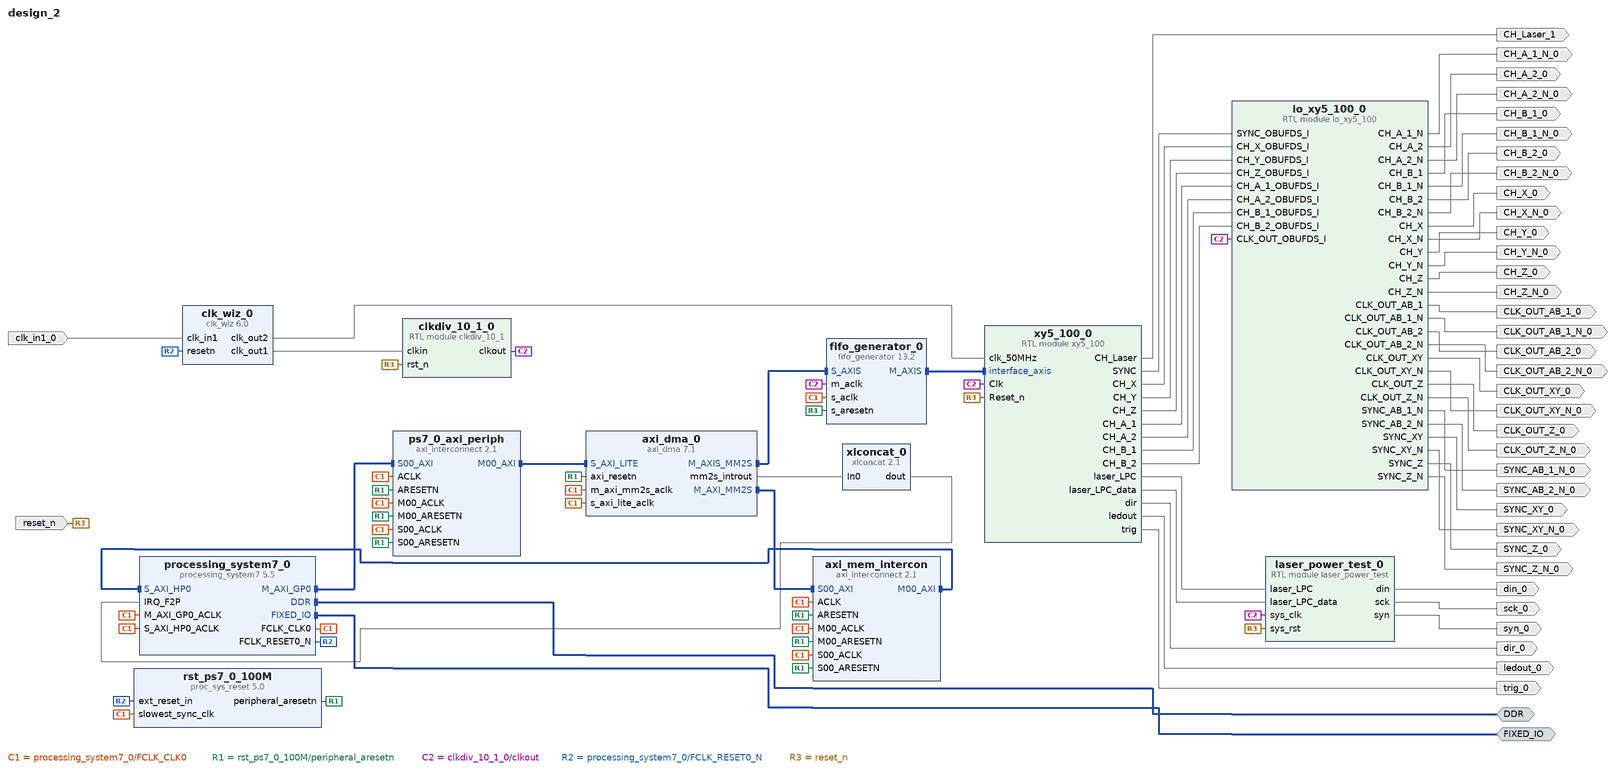
[diagram p0: block diagram of the top level]
# Vivado block design design_2, xc7z020clg400-2, Vivado 2020.2
create_bd_design design_2

create_bd_intf_port -mode Master -vlnv xilinx.com:interface:ddrx_rtl:1.0 DDR
create_bd_intf_port -mode Master -vlnv xilinx.com:display_processing_system7:fixedio_rtl:1.0 FIXED_IO
create_bd_port -dir I -type clk clk_in1_0
set_property -dict {CONFIG.FREQ_HZ 50000000} [get_bd_ports clk_in1_0]
create_bd_port -dir O CH_A_1_N_0
create_bd_port -dir O CH_A_2_0
create_bd_port -dir O CH_A_2_N_0
create_bd_port -dir O CH_B_1_0
create_bd_port -dir O CH_B_1_N_0
create_bd_port -dir O CH_B_2_0
create_bd_port -dir O CH_B_2_N_0
create_bd_port -dir O CH_X_0
create_bd_port -dir O CH_X_N_0
create_bd_port -dir O CH_Y_0
create_bd_port -dir O CH_Y_N_0
create_bd_port -dir O CH_Z_0
create_bd_port -dir O CH_Z_N_0
create_bd_port -dir O CLK_OUT_AB_1_0
create_bd_port -dir O CLK_OUT_AB_1_N_0
create_bd_port -dir O CLK_OUT_AB_2_0
create_bd_port -dir O CLK_OUT_AB_2_N_0
create_bd_port -dir O CLK_OUT_XY_0
create_bd_port -dir O CLK_OUT_XY_N_0
create_bd_port -dir O CLK_OUT_Z_0
create_bd_port -dir O CLK_OUT_Z_N_0
create_bd_port -dir O SYNC_AB_1_N_0
create_bd_port -dir O SYNC_AB_2_N_0
create_bd_port -dir O SYNC_XY_0
create_bd_port -dir O SYNC_XY_N_0
create_bd_port -dir O SYNC_Z_0
create_bd_port -dir O SYNC_Z_N_0
create_bd_port -dir I -type rst reset_n
create_bd_port -dir O ledout_0
create_bd_port -dir O CH_Laser_1
create_bd_port -dir O din_0
create_bd_port -dir O sck_0
create_bd_port -dir O syn_0
create_bd_port -dir O dir_0
create_bd_port -dir O trig_0

create_bd_cell -type ip -vlnv xilinx.com:ip:processing_system7:5.5 processing_system7_0
set_property -dict [list \
  CONFIG.PCW_APU_PERIPHERAL_FREQMHZ 666.666666 \
  CONFIG.PCW_CPU_CPU_6X4X_MAX_RANGE 767 \
  CONFIG.PCW_ENET0_ENET0_IO {MIO 16 .. 27} \
  CONFIG.PCW_ENET0_GRP_MDIO_ENABLE 1 \
  CONFIG.PCW_ENET0_GRP_MDIO_IO {MIO 52 .. 53} \
  CONFIG.PCW_ENET0_PERIPHERAL_ENABLE 1 \
  CONFIG.PCW_FPGA0_PERIPHERAL_FREQMHZ 100 \
  CONFIG.PCW_FPGA1_PERIPHERAL_FREQMHZ 50 \
  CONFIG.PCW_GPIO_MIO_GPIO_ENABLE 0 \
  CONFIG.PCW_IRQ_F2P_INTR 1 \
  CONFIG.PCW_PERIPHERAL_BOARD_PRESET None \
  CONFIG.PCW_PRESET_BANK1_VOLTAGE {LVCMOS 1.8V} \
  CONFIG.PCW_QSPI_PERIPHERAL_ENABLE 0 \
  CONFIG.PCW_SD0_GRP_CD_ENABLE 0 \
  CONFIG.PCW_SD0_GRP_WP_ENABLE 0 \
  CONFIG.PCW_SD0_PERIPHERAL_ENABLE 1 \
  CONFIG.PCW_SD0_SD0_IO {MIO 40 .. 45} \
  CONFIG.PCW_SDIO_PERIPHERAL_FREQMHZ 100 \
  CONFIG.PCW_UART0_PERIPHERAL_ENABLE 1 \
  CONFIG.PCW_UART0_UART0_IO {MIO 14 .. 15} \
  CONFIG.PCW_UART1_PERIPHERAL_ENABLE 0 \
  CONFIG.PCW_UART_PERIPHERAL_FREQMHZ 100 \
  CONFIG.PCW_UIPARAM_DDR_FREQ_MHZ 533.333333 \
  CONFIG.PCW_UIPARAM_DDR_PARTNO {MT41J256M16 RE-125} \
  CONFIG.PCW_USB0_PERIPHERAL_ENABLE 0 \
  CONFIG.PCW_USE_FABRIC_INTERRUPT 1 \
  CONFIG.PCW_USE_S_AXI_HP0 1 \
] [get_bd_cells processing_system7_0]
# 411 more settings of processing_system7_0 are not shown: defaults, MIO pin electricals, DDR timing, and values the tool derives
create_bd_cell -type module -reference clkdiv_10_1 clkdiv_10_1_0
create_bd_cell -type ip -vlnv xilinx.com:ip:axi_dma:7.1 axi_dma_0
set_property -dict [list \
  CONFIG.c_include_s2mm 0 \
  CONFIG.c_include_sg 0 \
  CONFIG.c_m_axi_mm2s_data_width 128 \
  CONFIG.c_m_axis_mm2s_tdata_width 128 \
  CONFIG.c_mm2s_burst_size 256 \
  CONFIG.c_sg_length_width 26 \
] [get_bd_cells axi_dma_0]
create_bd_cell -type ip -vlnv xilinx.com:ip:clk_wiz:6.0 clk_wiz_0
set_property -dict [list \
  CONFIG.CLKIN1_JITTER_PS 200.0 \
  CONFIG.CLKOUT1_JITTER 249.363 \
  CONFIG.CLKOUT1_PHASE_ERROR 164.985 \
  CONFIG.CLKOUT1_REQUESTED_OUT_FREQ 20.000 \
  CONFIG.CLKOUT2_JITTER 192.113 \
  CONFIG.CLKOUT2_PHASE_ERROR 164.985 \
  CONFIG.CLKOUT2_REQUESTED_OUT_FREQ 50.000 \
  CONFIG.CLKOUT2_USED true \
  CONFIG.MMCM_CLKFBOUT_MULT_F 20.000 \
  CONFIG.MMCM_CLKIN1_PERIOD 20.000 \
  CONFIG.MMCM_CLKIN2_PERIOD 10.0 \
  CONFIG.MMCM_CLKOUT0_DIVIDE_F 50.000 \
  CONFIG.MMCM_CLKOUT1_DIVIDE 20 \
  CONFIG.NUM_OUT_CLKS 2 \
  CONFIG.PRIM_IN_FREQ 50.000 \
  CONFIG.RESET_PORT resetn \
  CONFIG.RESET_TYPE ACTIVE_LOW \
] [get_bd_cells clk_wiz_0]
create_bd_cell -type ip -vlnv xilinx.com:ip:axi_interconnect:2.1 ps7_0_axi_periph
set_property -dict {CONFIG.NUM_MI 1} [get_bd_cells ps7_0_axi_periph]
create_bd_cell -type ip -vlnv xilinx.com:ip:proc_sys_reset:5.0 rst_ps7_0_100M
create_bd_cell -type ip -vlnv xilinx.com:ip:axi_interconnect:2.1 axi_mem_intercon
set_property -dict {CONFIG.NUM_MI 1} [get_bd_cells axi_mem_intercon]
create_bd_cell -type ip -vlnv xilinx.com:ip:xlconcat:2.1 xlconcat_0
create_bd_cell -type ip -vlnv xilinx.com:ip:fifo_generator:13.2 fifo_generator_0
set_property -dict [list \
  CONFIG.Clock_Type_AXI Independent_Clock \
  CONFIG.Enable_Safety_Circuit true \
  CONFIG.FIFO_Implementation_axis Independent_Clocks_Block_RAM \
  CONFIG.FIFO_Implementation_rach Independent_Clocks_Distributed_RAM \
  CONFIG.FIFO_Implementation_rdch Independent_Clocks_Block_RAM \
  CONFIG.FIFO_Implementation_wach Independent_Clocks_Distributed_RAM \
  CONFIG.FIFO_Implementation_wdch Independent_Clocks_Block_RAM \
  CONFIG.FIFO_Implementation_wrch Independent_Clocks_Distributed_RAM \
  CONFIG.Full_Flags_Reset_Value 1 \
  CONFIG.INTERFACE_TYPE AXI_STREAM \
  CONFIG.TDATA_NUM_BYTES 16 \
] [get_bd_cells fifo_generator_0]
create_bd_cell -type module -reference laser_power_test laser_power_test_0
create_bd_cell -type module -reference io_xy5_100 io_xy5_100_0
create_bd_cell -type module -reference xy5_100 xy5_100_0

# ---- connections ----

connect_bd_intf_net [get_bd_intf_pins fifo_generator_0/S_AXIS] [get_bd_intf_pins axi_dma_0/M_AXIS_MM2S]
connect_bd_intf_net [get_bd_intf_pins processing_system7_0/M_AXI_GP0] [get_bd_intf_pins ps7_0_axi_periph/S00_AXI]
connect_bd_intf_net [get_bd_intf_pins ps7_0_axi_periph/M00_AXI] [get_bd_intf_pins axi_dma_0/S_AXI_LITE]
connect_bd_intf_net [get_bd_intf_pins axi_mem_intercon/M00_AXI] [get_bd_intf_pins processing_system7_0/S_AXI_HP0]
connect_bd_intf_net [get_bd_intf_pins axi_dma_0/M_AXI_MM2S] [get_bd_intf_pins axi_mem_intercon/S00_AXI]
connect_bd_intf_net [get_bd_intf_ports DDR] [get_bd_intf_pins processing_system7_0/DDR]
connect_bd_intf_net [get_bd_intf_pins fifo_generator_0/M_AXIS] [get_bd_intf_pins xy5_100_0/interface_axis]
connect_bd_intf_net [get_bd_intf_ports FIXED_IO] [get_bd_intf_pins processing_system7_0/FIXED_IO]
connect_bd_net [get_bd_pins clk_wiz_0/clk_out1] [get_bd_pins clkdiv_10_1_0/clkin]
connect_bd_net -net clk_in1_0_1 [get_bd_ports clk_in1_0] [get_bd_pins clk_wiz_0/clk_in1]
connect_bd_net [get_bd_pins processing_system7_0/FCLK_CLK0] \
  [get_bd_pins processing_system7_0/M_AXI_GP0_ACLK] [get_bd_pins ps7_0_axi_periph/S00_ACLK] \
  [get_bd_pins rst_ps7_0_100M/slowest_sync_clk] [get_bd_pins axi_dma_0/s_axi_lite_aclk] \
  [get_bd_pins ps7_0_axi_periph/M00_ACLK] [get_bd_pins ps7_0_axi_periph/ACLK] [get_bd_pins axi_dma_0/m_axi_mm2s_aclk] \
  [get_bd_pins axi_mem_intercon/S00_ACLK] [get_bd_pins processing_system7_0/S_AXI_HP0_ACLK] \
  [get_bd_pins axi_mem_intercon/M00_ACLK] [get_bd_pins axi_mem_intercon/ACLK] [get_bd_pins fifo_generator_0/s_aclk]
connect_bd_net [get_bd_pins rst_ps7_0_100M/peripheral_aresetn] \
  [get_bd_pins ps7_0_axi_periph/S00_ARESETN] [get_bd_pins axi_dma_0/axi_resetn] [get_bd_pins ps7_0_axi_periph/M00_ARESETN] \
  [get_bd_pins ps7_0_axi_periph/ARESETN] [get_bd_pins axi_mem_intercon/S00_ARESETN] \
  [get_bd_pins axi_mem_intercon/M00_ARESETN] [get_bd_pins axi_mem_intercon/ARESETN] [get_bd_pins fifo_generator_0/s_aresetn]
connect_bd_net [get_bd_pins xy5_100_0/SYNC] [get_bd_pins io_xy5_100_0/SYNC_OBUFDS_I]
connect_bd_net [get_bd_pins xy5_100_0/CH_X] [get_bd_pins io_xy5_100_0/CH_X_OBUFDS_I]
connect_bd_net [get_bd_pins xy5_100_0/CH_Y] [get_bd_pins io_xy5_100_0/CH_Y_OBUFDS_I]
connect_bd_net [get_bd_pins xy5_100_0/CH_Z] [get_bd_pins io_xy5_100_0/CH_Z_OBUFDS_I]
connect_bd_net [get_bd_pins xy5_100_0/CH_A_1] [get_bd_pins io_xy5_100_0/CH_A_1_OBUFDS_I]
connect_bd_net [get_bd_pins xy5_100_0/CH_A_2] [get_bd_pins io_xy5_100_0/CH_A_2_OBUFDS_I]
connect_bd_net [get_bd_pins xy5_100_0/CH_B_1] [get_bd_pins io_xy5_100_0/CH_B_1_OBUFDS_I]
connect_bd_net [get_bd_pins xy5_100_0/CH_B_2] [get_bd_pins io_xy5_100_0/CH_B_2_OBUFDS_I]
connect_bd_net [get_bd_pins io_xy5_100_0/CH_A_1_N] [get_bd_ports CH_A_1_N_0]
connect_bd_net [get_bd_pins io_xy5_100_0/CH_A_2] [get_bd_ports CH_A_2_0]
connect_bd_net [get_bd_pins io_xy5_100_0/CH_A_2_N] [get_bd_ports CH_A_2_N_0]
connect_bd_net [get_bd_pins io_xy5_100_0/CH_B_1] [get_bd_ports CH_B_1_0]
connect_bd_net [get_bd_pins io_xy5_100_0/CH_B_1_N] [get_bd_ports CH_B_1_N_0]
connect_bd_net [get_bd_pins io_xy5_100_0/CH_B_2] [get_bd_ports CH_B_2_0]
connect_bd_net [get_bd_pins io_xy5_100_0/CH_B_2_N] [get_bd_ports CH_B_2_N_0]
connect_bd_net [get_bd_pins io_xy5_100_0/CH_X] [get_bd_ports CH_X_0]
connect_bd_net [get_bd_pins io_xy5_100_0/CH_X_N] [get_bd_ports CH_X_N_0]
connect_bd_net [get_bd_pins io_xy5_100_0/CH_Y] [get_bd_ports CH_Y_0]
connect_bd_net [get_bd_pins io_xy5_100_0/CH_Y_N] [get_bd_ports CH_Y_N_0]
connect_bd_net [get_bd_pins io_xy5_100_0/CH_Z] [get_bd_ports CH_Z_0]
connect_bd_net [get_bd_pins io_xy5_100_0/CH_Z_N] [get_bd_ports CH_Z_N_0]
connect_bd_net [get_bd_pins io_xy5_100_0/CLK_OUT_AB_1] [get_bd_ports CLK_OUT_AB_1_0]
connect_bd_net [get_bd_pins io_xy5_100_0/CLK_OUT_AB_1_N] [get_bd_ports CLK_OUT_AB_1_N_0]
connect_bd_net [get_bd_pins io_xy5_100_0/CLK_OUT_AB_2] [get_bd_ports CLK_OUT_AB_2_0]
connect_bd_net [get_bd_pins io_xy5_100_0/CLK_OUT_AB_2_N] [get_bd_ports CLK_OUT_AB_2_N_0]
connect_bd_net [get_bd_pins io_xy5_100_0/CLK_OUT_XY] [get_bd_ports CLK_OUT_XY_0]
connect_bd_net [get_bd_pins io_xy5_100_0/CLK_OUT_XY_N] [get_bd_ports CLK_OUT_XY_N_0]
connect_bd_net [get_bd_pins io_xy5_100_0/CLK_OUT_Z] [get_bd_ports CLK_OUT_Z_0]
connect_bd_net [get_bd_pins io_xy5_100_0/CLK_OUT_Z_N] [get_bd_ports CLK_OUT_Z_N_0]
connect_bd_net [get_bd_pins io_xy5_100_0/SYNC_AB_1_N] [get_bd_ports SYNC_AB_1_N_0]
connect_bd_net [get_bd_pins io_xy5_100_0/SYNC_AB_2_N] [get_bd_ports SYNC_AB_2_N_0]
connect_bd_net [get_bd_pins io_xy5_100_0/SYNC_XY] [get_bd_ports SYNC_XY_0]
connect_bd_net [get_bd_pins io_xy5_100_0/SYNC_XY_N] [get_bd_ports SYNC_XY_N_0]
connect_bd_net [get_bd_pins io_xy5_100_0/SYNC_Z] [get_bd_ports SYNC_Z_0]
connect_bd_net [get_bd_pins io_xy5_100_0/SYNC_Z_N] [get_bd_ports SYNC_Z_N_0]
connect_bd_net [get_bd_pins xy5_100_0/ledout] [get_bd_ports ledout_0]
connect_bd_net [get_bd_pins clkdiv_10_1_0/clkout] \
  [get_bd_pins fifo_generator_0/m_aclk] [get_bd_pins laser_power_test_0/sys_clk] [get_bd_pins io_xy5_100_0/CLK_OUT_OBUFDS_I] \
  [get_bd_pins xy5_100_0/Clk]
connect_bd_net [get_bd_pins processing_system7_0/FCLK_RESET0_N] [get_bd_pins clk_wiz_0/resetn] [get_bd_pins rst_ps7_0_100M/ext_reset_in]
connect_bd_net [get_bd_pins axi_dma_0/mm2s_introut] [get_bd_pins xlconcat_0/In0]
connect_bd_net [get_bd_pins xlconcat_0/dout] [get_bd_pins processing_system7_0/IRQ_F2P]
connect_bd_net [get_bd_ports reset_n] [get_bd_pins clkdiv_10_1_0/rst_n] [get_bd_pins laser_power_test_0/sys_rst] [get_bd_pins xy5_100_0/Reset_n]
connect_bd_net [get_bd_pins xy5_100_0/CH_Laser] [get_bd_ports CH_Laser_1]
connect_bd_net [get_bd_pins xy5_100_0/laser_LPC] [get_bd_pins laser_power_test_0/laser_LPC]
connect_bd_net [get_bd_pins xy5_100_0/laser_LPC_data] [get_bd_pins laser_power_test_0/laser_LPC_data]
connect_bd_net [get_bd_pins laser_power_test_0/din] [get_bd_ports din_0]
connect_bd_net [get_bd_pins laser_power_test_0/sck] [get_bd_ports sck_0]
connect_bd_net [get_bd_pins laser_power_test_0/syn] [get_bd_ports syn_0]
connect_bd_net [get_bd_pins xy5_100_0/dir] [get_bd_ports dir_0]
connect_bd_net [get_bd_pins xy5_100_0/trig] [get_bd_ports trig_0]
connect_bd_net [get_bd_pins clk_wiz_0/clk_out2] [get_bd_pins xy5_100_0/clk_50MHz]

# ---- address map ----
assign_bd_address -offset 0x00000000 -range 1G -target_address_space [get_bd_addr_spaces axi_dma_0/Data_MM2S] [get_bd_addr_segs processing_system7_0/S_AXI_HP0/HP0_DDR_LOWOCM]
assign_bd_address -offset 0x40400000 -range 64K -target_address_space [get_bd_addr_spaces processing_system7_0/Data] [get_bd_addr_segs axi_dma_0/S_AXI_LITE/Reg]

validate_bd_design
save_bd_design
